# Altium schematic sheet 0_architecture.SchDoc: FlatSat Hardware Architecture
size A4; Organization: UFSC; DocumentNumber: 1; SheetNumber: 1; SheetTotal: 3
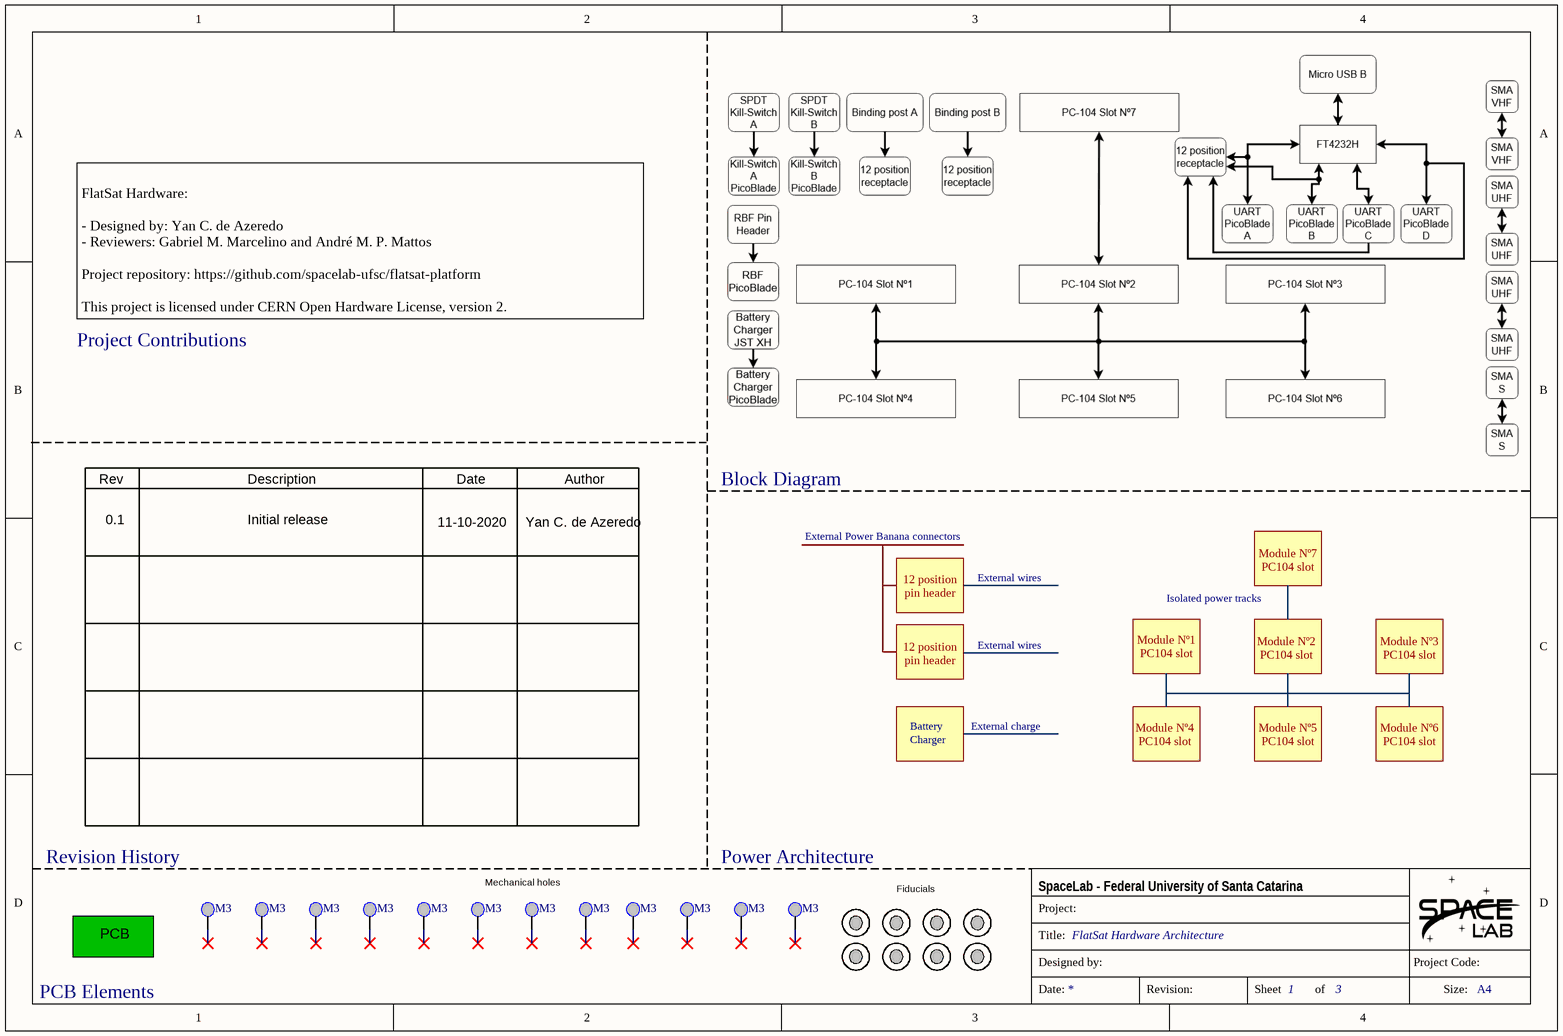
[diagram p0: 0_architecture.SchDoc]

## Parts
_PCB1  PCB spec  (value not drawn)  (no BOM)
FD1  Fiducial 1.3  [Fiducial 1.3mm]  (value not drawn)  (no BOM)
FD2  Fiducial 1.3  [Fiducial 1.3mm]  (value not drawn)  (no BOM)
FD3  Fiducial 1.3  [Fiducial 1.3mm]  (value not drawn)  (no BOM)
FD4  Fiducial 1.3  [Fiducial 1.3mm]  (value not drawn)  (no BOM)
FD5  Fiducial 1.3  [Fiducial 1.3mm]  (value not drawn)  (no BOM)
FD6  Fiducial 1.3  [Fiducial 1.3mm]  (value not drawn)  (no BOM)
FD7  Fiducial 1.3  [Fiducial 1.3mm]  (value not drawn)  (no BOM)
FD8  Fiducial 1.3  [Fiducial 1.3mm]  (value not drawn)  (no BOM)
MEC1  M3  [M3 hole]  (no BOM)
MEC2  M3  [M3 hole]  (no BOM)
MEC3  M3  [M3 hole]  (no BOM)
MEC4  M3  [M3 hole]  (no BOM)
MEC5  M3  [M3 hole]  (no BOM)
MEC6  M3  [M3 hole]  (no BOM)
MEC7  M3  [M3 hole]  (no BOM)
MEC8  M3  [M3 hole]  (no BOM)
MEC9  M3  [M3 hole]  (no BOM)
MEC10  M3  [M3 hole]  (no BOM)
MEC11  M3  [M3 hole]  (no BOM)
MEC12  M3  [M3 hole]  (no BOM)

## Nets

Not connected (* = marked no-connect by the designer): MEC1 0*; MEC2 0*; MEC3 0*; MEC4 0*; MEC5 0*; MEC6 0*; MEC7 0*; MEC8 0*; MEC9 0*; MEC10 0*; MEC11 0*; MEC12 0*

## Notes on the sheet
- FlatSat Hardware:
  - Designed by: Yan C. de Azeredo
  - Reviewers: Gabriel M. Marcelino and André M. P. Mattos
  Project repository: https://github.com/spacelab-ufsc/flatsat-platform
  This project is licensed under CERN Open Hardware License, version 2.
- Project Contributions
- Rev
- Description
- Date
- Author
- Block Diagram
- 0.1
- Initial release
- 11-10-2020
- Yan C. de Azeredo
- External Power Banana connectors
- External wires
- Module Nº7
  PC104 slot
- 12 position
  pin header
- Module Nº1
  PC104 slot
- Isolated power tracks
- Module Nº2
  PC104 slot
- Module Nº3
  PC104 slot
- Battery
- Charger
- External charge
- Module Nº4
  PC104 slot
- Module Nº5
  PC104 slot
- Module Nº6
  PC104 slot
- Revision History
- Mechanical holes
- Power Architecture
- Fiducials
- (near _PCB1) PCB Elements
- Project:
- SpaceLab - Federal University of Santa Catarina
- Title:
- Designed by:
- Project Code:
- Date:
- Revision:
- Sheet
- of
- Size:
- A4

## Library data of the parts
_PCB1 = PCB
FD1-FD8 = Fiducial 1.3: Fiducial 1.3mm
MEC1-MEC12 = M3 hole